# Altium schematic sheet node-circuits.SchDoc
size A; SheetNumber: 2; SheetTotal: 3
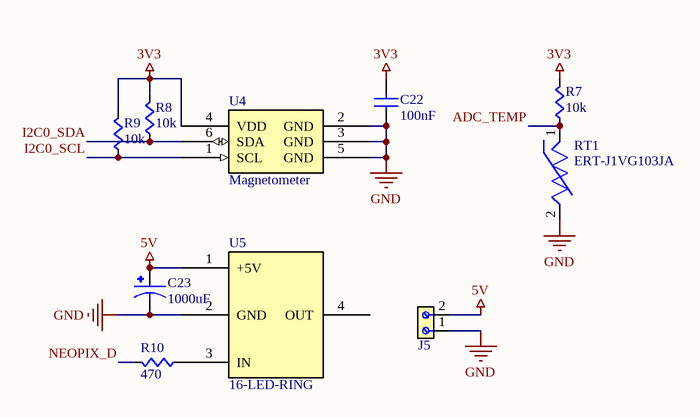
[diagram p0: node-circuits.SchDoc]

## Parts
C22  value 100nF  [CAPC0603]  (hidden comment: Cap)
C23  1000uF  [CAPPRD350W60D800H1150]
J5  [Connector] 691213510002  [[CONNECTOR] 5MM_2PORT_SCREW]  (value not drawn)
R7  value 10k  [RES0603]  (hidden comment: Res)
R8  value 10k  [RES0603]  (hidden comment: Res)
R9  value 10k  [RES0603]  (hidden comment: Res)
R10  value 470  [RES0603]  (hidden comment: Res)
RT1  ERT-J1VG103JA  [THERM_ERT-J1VG103JA]
U4  Magnetometer  [PG-TSOP6-6-5_INF]
U5  16-LED-RING  [WS2812-16-RING]

## Nets
3V3: C22.1(A) R7.1(A) R8.1(A) R9.1(A) U4.4(VDD)
5V: C23.P J5.2 U5.1(+5V)
GND: C22.2(B) C23.N J5.1 RT1.2 U4.2(GND) U4.3(GND) U4.5(GND) U5.2(GND)
ADC_TEMP: R7.2(B) RT1.1
I2C0_SCL: R9.2(B) U4.1(SCL)
I2C0_SDA: R8.2(B) U4.6(SDA)
NEOPIX_D: R10.1(A)
NetR10_2: R10.2(B) U5.3(IN)

Not connected (* = marked no-connect by the designer): U5 4(OUT)

## Library data of the parts
C23 = EEUFM1H101: EEUFM1H101. Cap Aluminum Lytic 100uF 50V 20% (8 X 11.5mm) Radial 3.5mm 870mA 3000h 105?ÂÂŽ Bulk; MF: Panasonic; Package: RADIAL-2 Panasonic; MP: EEUFM1H101; Check_prices: https://www.snapeda.com/parts/EEUFM1H101/Panasonic/view-part/1510333/?ref=eda; Value: *; Price: None; Availability: In Stock; SnapEDA_Link: https://www.snapeda.com/parts/EEUFM1H101/Panasonic/view-part/1510333/?ref=snap
J5 = [Connector] 691213510002: 2 Position Wire to Board Terminal Block Horizontal with Board 0.200 (5.08mm) Through Hole; MF: WÃ¼rth Elektronik; SnapEDA_Link: https://www.snapeda.com/parts/691213510002/W%25C3%25BCrth+Elektronik+Midcom/view-part/?ref=snap; Package: None; Value: *; MP: 691213510002; Check_prices: https://www.snapeda.com/parts/691213510002/W%25C3%25BCrth+Elektronik+Midcom/view-part/?ref=eda
R7-R10 = Res: SMD, RES0603; Supplier 1: Digi-Key; Supplier Part Number 1: RMCF0603JT10K0CT-ND
RT1 = ERT-J1VG103JA: Series/Type: NTC Thermistor(Chip type), Style: 0603, B Value (K): 3301 to 3400, Resistance Tolerance (%): Â±5, Resistance R25 (â„¦): 10000; MF: Panasonic Electronic; SnapEDA_Link: https://www.snapeda.com/parts/ERT-J1VG103JA/Panasonic+Electronic+Components/view-part/?ref=snap; Package: 0603-2 Panasonic; Value: *; MP: ERT-J1VG103JA; Check_prices: https://www.snapeda.com/parts/ERT-J1VG103JA/Panasonic+Electronic+Components/view-part/?ref=eda
U4 = TLV493DA1B6HTSA2: The Infineon TLV493D-A1B6 magnetic sensor offers accurate three dimensional sensing with extremely low power consumption in a small 6-pin package. With an opportunity to detect the magnetic field in x, y, and z-direction the sensor is ideally suited for the measurement of 3D movements, linear movements and rotation movements. It is usable in any kind of industrial and consumer applications that require a low power consumption.; Copyright: Copyright (C) 2025 Ultra Librarian. All rights reserved.; Manufacturer_Name: Infineon; Manufacturer_Part_Number: TLV493DA1B6HTSA2; RefDes: RefDes; Type: Type
U5 = WS2812B-16-LED-RING: 16-LED Ring, RGB WS2812 neopixels
C22 = Cap: Supplier 1: Digi-Key; Supplier Part Number 1: 1276-1000-1-ND